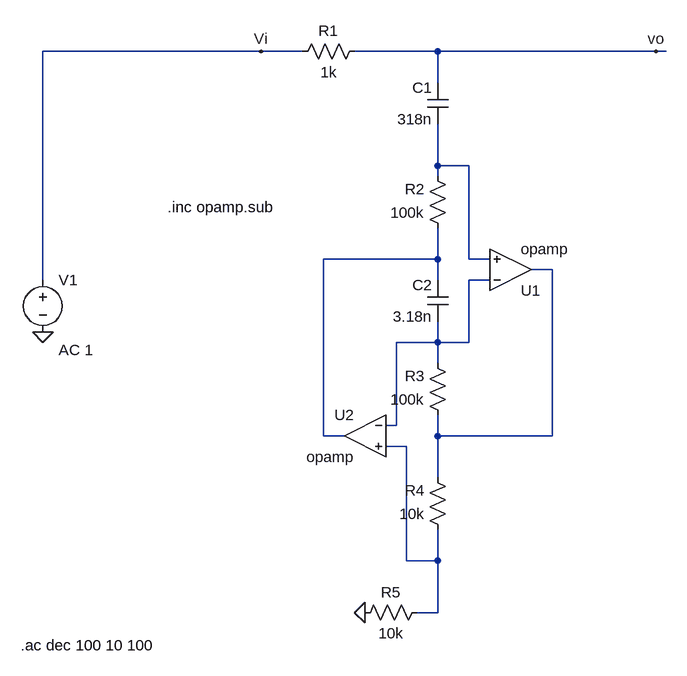
[diagram p0: schematic ej9.asc]
ej9.asc, the LTspice schematic file:
Version 4
SHEET 1 1076 1044
WIRE 48 112 -288 112
WIRE 112 112 48 112
WIRE 320 112 192 112
WIRE 656 112 320 112
WIRE 672 112 656 112
WIRE 320 160 320 112
WIRE 320 288 320 224
WIRE 368 288 320 288
WIRE 320 304 320 288
WIRE 320 432 320 384
WIRE 320 432 144 432
WIRE 368 432 368 288
WIRE 400 432 368 432
WIRE 496 448 464 448
WIRE -288 464 -288 112
WIRE 320 464 320 432
WIRE 400 464 368 464
WIRE 320 560 320 528
WIRE 320 560 256 560
WIRE 368 560 368 464
WIRE 368 560 320 560
WIRE 320 592 320 560
WIRE 256 688 256 560
WIRE 256 688 240 688
WIRE 144 704 144 432
WIRE 176 704 144 704
WIRE 320 704 320 672
WIRE 496 704 496 448
WIRE 496 704 320 704
WIRE 272 720 240 720
WIRE 320 768 320 704
WIRE 272 896 272 720
WIRE 320 896 320 848
WIRE 320 896 272 896
WIRE 320 976 320 896
WIRE 320 976 288 976
FLAG 48 112 Vi
FLAG 208 976 0
FLAG -288 544 0
FLAG 656 112 vo
SYMBOL res 208 96 R90
WINDOW 0 0 56 VBottom 2
WINDOW 3 32 56 VTop 2
SYMATTR InstName R1
SYMATTR Value 1k
SYMBOL cap 336 224 R180
WINDOW 0 24 56 Left 2
WINDOW 3 24 8 Left 2
SYMATTR InstName C1
SYMATTR Value 318n
SYMBOL res 336 400 R180
WINDOW 0 36 76 Left 2
WINDOW 3 36 40 Left 2
SYMATTR InstName R2
SYMATTR Value 100k
SYMBOL cap 336 528 R180
WINDOW 0 24 56 Left 2
WINDOW 3 24 8 Left 2
SYMATTR InstName C2
SYMATTR Value 3.18n
SYMBOL res 336 688 R180
WINDOW 0 36 76 Left 2
WINDOW 3 36 40 Left 2
SYMATTR InstName R3
SYMATTR Value 100k
SYMBOL res 336 864 R180
WINDOW 0 36 76 Left 2
WINDOW 3 36 40 Left 2
SYMATTR InstName R4
SYMATTR Value 10k
SYMBOL res 192 992 R270
WINDOW 0 32 56 VTop 2
WINDOW 3 0 56 VBottom 2
SYMATTR InstName R5
SYMATTR Value 10k
SYMBOL OpAmps\\opamp 432 512 M180
SYMATTR InstName U1
SYMBOL OpAmps\\opamp 208 640 M0
SYMATTR InstName U2
SYMBOL voltage -288 448 R0
WINDOW 123 24 124 Left 2
WINDOW 39 0 0 Left 0
SYMATTR InstName V1
SYMATTR Value ""
SYMATTR Value2 AC 1
TEXT -322 1026 Left 2 !.ac dec 100 10 100
TEXT -96 352 Left 2 !.inc opamp.sub

The netlist it stands for:
* ej9.asc
R1 vo Vi 1k
C1 N001 vo 318n
R2 N002 N001 100k
C2 N004 N002 3.18n
R3 N003 N004 100k
R4 N005 N003 10k
R5 0 N005 10k
XU1 N004 N001 N003 opamp Aol=100K GBW=10Meg  ; pins invin noninvin out
XU2 N004 N005 N002 opamp Aol=100K GBW=10Meg  ; pins invin noninvin out
V1 Vi 0 AC 1
.ac dec 100 10 100
.inc opamp.sub
.backanno
.end